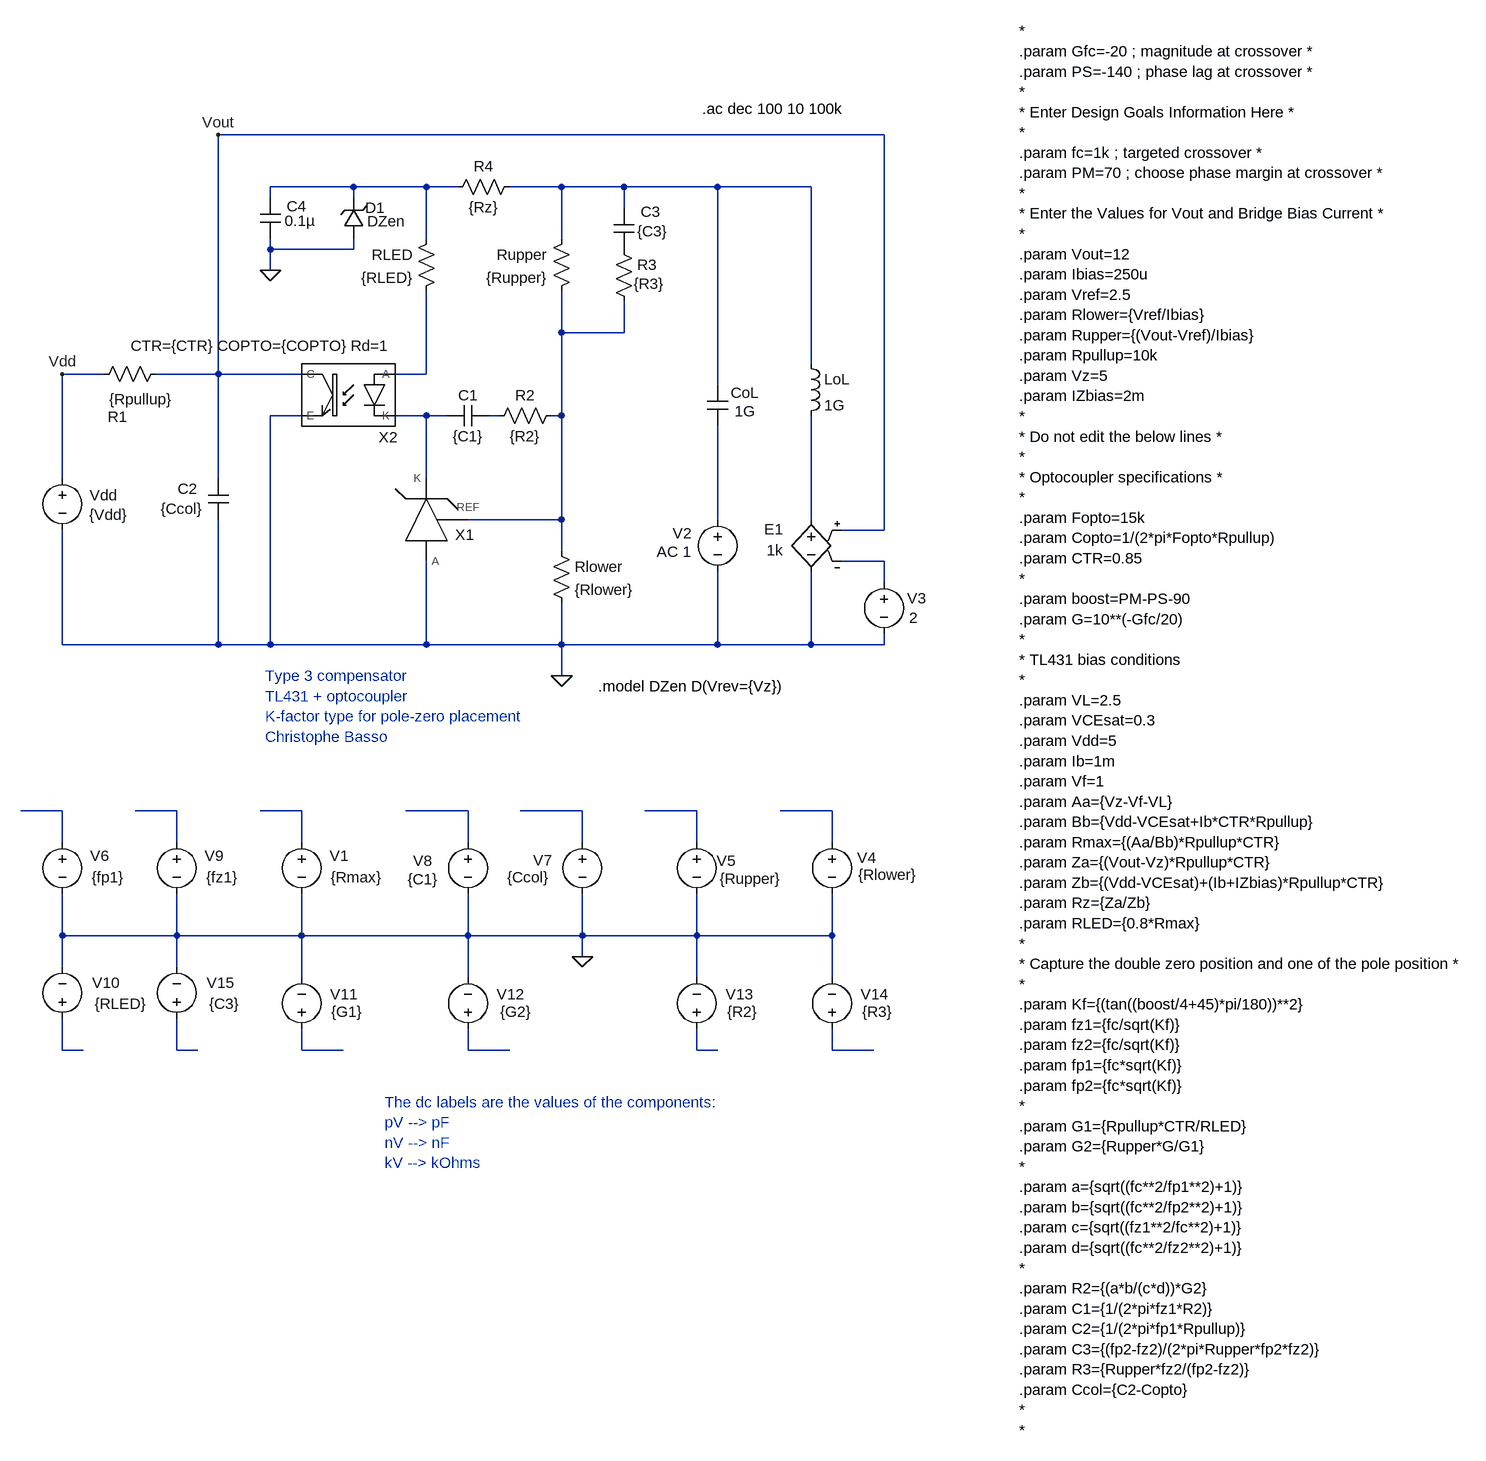
[diagram p0: schematic type 3 - TL431 - no fast lane.asc]
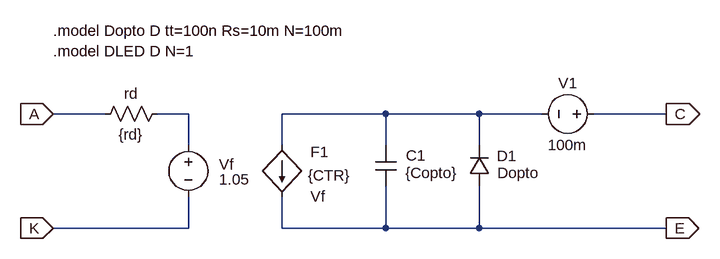
[diagram p1: sub-circuit optotof.asc]
type 3 - TL431 - no fast lane.asc, the LTspice schematic file:
Version 4.1
SHEET 1 2200 1456
WIRE 896 -400 -128 -400
WIRE 80 -320 -48 -320
WIRE 192 -320 80 -320
WIRE 240 -320 192 -320
WIRE 400 -320 320 -320
WIRE 496 -320 400 -320
WIRE 640 -320 496 -320
WIRE 784 -320 640 -320
WIRE -48 -304 -48 -320
WIRE 80 -304 80 -320
WIRE 496 -288 496 -320
WIRE 192 -240 192 -320
WIRE 400 -240 400 -320
WIRE -48 -224 -48 -240
WIRE 80 -224 80 -240
WIRE 80 -224 -48 -224
WIRE -48 -192 -48 -224
WIRE 400 -96 400 -160
WIRE 496 -96 496 -144
WIRE 496 -96 400 -96
WIRE 784 -48 784 -320
WIRE -304 -32 -368 -32
WIRE -128 -32 -128 -400
WIRE -128 -32 -224 -32
WIRE 0 -32 -128 -32
WIRE 192 -32 192 -160
WIRE 192 -32 144 -32
WIRE 640 -16 640 -320
WIRE 0 32 -48 32
WIRE 192 32 144 32
WIRE 224 32 192 32
WIRE 304 32 288 32
WIRE 400 32 400 -96
WIRE 400 32 384 32
WIRE -368 128 -368 -32
WIRE -128 128 -128 -32
WIRE 192 128 192 32
WIRE 400 192 400 32
WIRE 400 192 256 192
WIRE 640 192 640 48
WIRE 784 192 784 32
WIRE 896 208 896 -400
WIRE 896 208 832 208
WIRE 400 240 400 192
WIRE 896 256 832 256
WIRE 896 288 896 256
WIRE -368 384 -368 208
WIRE -128 384 -128 192
WIRE -128 384 -368 384
WIRE -48 384 -48 32
WIRE -48 384 -128 384
WIRE 192 384 192 256
WIRE 192 384 -48 384
WIRE 400 384 400 320
WIRE 400 384 192 384
WIRE 640 384 640 272
WIRE 640 384 400 384
WIRE 784 384 784 272
WIRE 784 384 640 384
WIRE 896 384 896 368
WIRE 896 384 784 384
WIRE 400 432 400 384
WIRE -368 640 -432 640
WIRE -192 640 -256 640
WIRE 0 640 -64 640
WIRE 256 640 160 640
WIRE 432 640 336 640
WIRE 608 640 528 640
WIRE 816 640 736 640
WIRE -368 688 -368 640
WIRE -192 688 -192 640
WIRE 0 688 0 640
WIRE 256 688 256 640
WIRE 432 688 432 640
WIRE 608 688 608 640
WIRE 816 688 816 640
WIRE -368 832 -368 768
WIRE -192 832 -192 768
WIRE -192 832 -368 832
WIRE 0 832 0 768
WIRE 0 832 -192 832
WIRE 256 832 256 768
WIRE 256 832 0 832
WIRE 432 832 432 768
WIRE 432 832 256 832
WIRE 608 832 608 768
WIRE 608 832 432 832
WIRE 816 832 816 768
WIRE 816 832 608 832
WIRE 432 864 432 832
WIRE -368 880 -368 832
WIRE -192 880 -192 832
WIRE 0 896 0 832
WIRE 256 896 256 832
WIRE 608 896 608 832
WIRE 816 896 816 832
WIRE -368 1008 -368 960
WIRE -336 1008 -368 1008
WIRE -192 1008 -192 960
WIRE -160 1008 -192 1008
WIRE 0 1008 0 976
WIRE 64 1008 0 1008
WIRE 256 1008 256 976
WIRE 320 1008 256 1008
WIRE 608 1008 608 976
WIRE 640 1008 608 1008
WIRE 816 1008 816 976
WIRE 880 1008 816 1008
FLAG -128 -400 Vout
FLAG 432 864 0
FLAG 400 432 0
FLAG -368 -32 Vdd
FLAG -48 -192 0
DATAFLAG 704 -320 ""
DATAFLAG 112 -400 ""
DATAFLAG 176 640 ""
DATAFLAG 368 640 ""
DATAFLAG 544 640 ""
DATAFLAG 768 640 ""
DATAFLAG 336 192 ""
DATAFLAG -48 640 ""
DATAFLAG -416 640 ""
DATAFLAG -240 640 ""
DATAFLAG -336 1008 ""
DATAFLAG 64 1008 ""
DATAFLAG 320 1008 ""
DATAFLAG 640 1008 ""
DATAFLAG 880 1008 ""
DATAFLAG -160 1008 ""
DATAFLAG 80 -320 ""
SYMBOL res 384 224 R0
SYMATTR InstName Rlower
SYMATTR Value {Rlower}
SYMBOL res 416 -256 M0
SYMATTR InstName Rupper
SYMATTR Value {Rupper}
SYMBOL cap 624 -16 R0
WINDOW 0 36 13 Left 2
WINDOW 3 42 41 Left 2
SYMATTR InstName CoL
SYMATTR Value 1G
SYMBOL voltage 640 176 M0
WINDOW 0 40 37 Left 2
WINDOW 123 40 65 Left 2
WINDOW 39 0 0 Left 0
SYMATTR InstName V2
SYMATTR Value2 AC 1
SYMATTR Value ""
SYMBOL ind 768 -64 R0
SYMATTR InstName LoL
SYMATTR Value 1G
SYMBOL e 784 176 M0
WINDOW 0 43 31 Left 2
WINDOW 3 43 63 Left 2
SYMATTR InstName E1
SYMATTR Value 1k
SYMBOL voltage 896 272 R0
WINDOW 0 36 41 Left 2
WINDOW 3 39 71 Left 2
SYMATTR InstName V3
SYMATTR Value 2
SYMBOL voltage 816 672 R0
WINDOW 0 39 40 Left 2
WINDOW 3 40 66 Left 2
WINDOW 123 0 0 Left 0
WINDOW 39 0 0 Left 0
SYMATTR InstName V4
SYMATTR Value {Rlower}
SYMBOL voltage 608 672 R0
WINDOW 0 31 45 Left 2
WINDOW 3 35 72 Left 2
WINDOW 123 0 0 Left 0
WINDOW 39 0 0 Left 0
SYMATTR InstName V5
SYMATTR Value {Rupper}
SYMBOL voltage 432 672 R0
WINDOW 0 -76 44 Left 2
WINDOW 3 -116 70 Left 2
SYMATTR InstName V7
SYMATTR Value {Ccol}
SYMBOL voltage 256 672 R0
WINDOW 0 -84 45 Left 2
WINDOW 3 -93 73 Left 2
WINDOW 123 0 0 Left 0
WINDOW 39 0 0 Left 0
SYMATTR InstName V8
SYMATTR Value {C1}
SYMBOL TL431TOF 176 144 R0
WINDOW 0 75 87 Bottom 2
SYMATTR InstName X1
SYMBOL res 208 -256 M0
SYMATTR InstName RLED
SYMATTR Value {RLED}
SYMBOL cap 288 16 R90
WINDOW 0 0 32 VBottom 2
WINDOW 3 32 32 VTop 2
SYMATTR InstName C1
SYMATTR Value {C1}
SYMBOL optoTOF 32 0 M0
WINDOW 0 -101 81 Bottom 2
WINDOW 39 93 -60 Bottom 2
SYMATTR InstName X2
SYMATTR SpiceLine CTR={CTR} COPTO={COPTO} Rd=1
SYMBOL cap -112 128 M0
WINDOW 0 48 16 Left 2
WINDOW 3 40 47 Left 2
SYMATTR InstName C2
SYMATTR Value {Ccol}
SYMBOL res -208 -48 R90
WINDOW 0 97 75 VBottom 2
WINDOW 3 39 39 VTop 2
SYMATTR InstName R1
SYMATTR Value {Rpullup}
SYMBOL voltage -368 112 R0
WINDOW 0 42 42 Left 2
WINDOW 3 41 72 Left 2
SYMATTR InstName Vdd
SYMATTR Value {Vdd}
SYMBOL voltage 0 672 R0
WINDOW 0 43 37 Left 2
WINDOW 3 45 70 Left 2
WINDOW 123 0 0 Left 0
WINDOW 39 0 0 Left 0
SYMATTR InstName V1
SYMATTR Value {Rmax}
SYMBOL voltage -368 672 R0
WINDOW 0 43 37 Left 2
WINDOW 3 45 70 Left 2
WINDOW 123 0 0 Left 0
WINDOW 39 0 0 Left 0
SYMATTR InstName V6
SYMATTR Value {fp1}
SYMBOL voltage -192 672 R0
WINDOW 0 43 37 Left 2
WINDOW 3 45 70 Left 2
WINDOW 123 0 0 Left 0
WINDOW 39 0 0 Left 0
SYMATTR InstName V9
SYMATTR Value {fz1}
SYMBOL voltage -368 976 M180
WINDOW 0 46 72 Left 2
WINDOW 3 50 39 Left 2
SYMATTR InstName V10
SYMATTR Value {RLED}
SYMBOL res 400 16 R90
WINDOW 0 0 56 VBottom 2
WINDOW 3 32 56 VTop 2
SYMATTR InstName R2
SYMATTR Value {R2}
SYMBOL voltage 0 992 R180
WINDOW 0 -87 70 Left 2
WINDOW 3 -94 43 Left 2
SYMATTR InstName V11
SYMATTR Value {G1}
SYMBOL cap 480 -288 R0
WINDOW 0 42 6 Left 2
WINDOW 3 36 36 Left 2
SYMATTR InstName C3
SYMATTR Value {C3}
SYMBOL res 480 -240 R0
WINDOW 3 31 69 Left 2
SYMATTR Value {R3}
SYMATTR InstName R3
SYMBOL res 336 -336 R90
WINDOW 0 0 56 VBottom 2
WINDOW 3 32 56 VTop 2
SYMATTR InstName R4
SYMATTR Value {Rz}
SYMBOL zener 96 -240 R180
WINDOW 0 -33 48 Left 2
WINDOW 3 -64 27 Left 2
SYMATTR InstName D1
SYMATTR Value DZen
SYMBOL cap -64 -304 R0
WINDOW 0 41 14 Left 2
WINDOW 3 38 36 Left 2
SYMATTR InstName C4
SYMATTR Value 0.1µ
SYMBOL voltage 256 992 R180
WINDOW 0 -87 70 Left 2
WINDOW 3 -98 43 Left 2
SYMATTR InstName V12
SYMATTR Value {G2}
SYMBOL voltage 608 992 R180
WINDOW 0 -87 70 Left 2
WINDOW 3 -94 43 Left 2
SYMATTR InstName V13
SYMATTR Value {R2}
SYMBOL voltage 816 992 R180
WINDOW 0 -87 70 Left 2
WINDOW 3 -94 43 Left 2
SYMATTR InstName V14
SYMATTR Value {R3}
SYMBOL voltage -192 976 M180
WINDOW 0 46 72 Left 2
WINDOW 3 50 39 Left 2
SYMATTR InstName V15
SYMATTR Value {C3}
TEXT 1104 -560 Left 2 !*\n.param Gfc=-20 ; magnitude at crossover *\n.param PS=-140 ; phase lag at crossover *\n*\n* Enter Design Goals Information Here *\n*\n.param fc=1k ; targeted crossover *\n.param PM=70 ; choose phase margin at crossover *\n*\n* Enter the Values for Vout and Bridge Bias Current *\n*\n.param Vout=12\n.param Ibias=250u\n.param Vref=2.5\n.param Rlower={Vref/Ibias}\n.param Rupper={(Vout-Vref)/Ibias}\n.param Rpullup=10k\n.param Vz=5\n.param IZbias=2m\n*\n* Do not edit the below lines *\n*\n* Optocoupler specifications *\n*\n.param Fopto=15k\n.param Copto=1/(2*pi*Fopto*Rpullup)\n.param CTR=0.85\n*\n.param boost=PM-PS-90 \n.param G=10**(-Gfc/20)\n*\n* TL431 bias conditions\n*\n.param VL=2.5\n.param VCEsat=0.3\n.param Vdd=5\n.param Ib=1m\n.param Vf=1\n.param Aa={Vz-Vf-VL}\n.param Bb={Vdd-VCEsat+Ib*CTR*Rpullup}\n.param Rmax={(Aa/Bb)*Rpullup*CTR}\n.param Za={(Vout-Vz)*Rpullup*CTR}\n.param Zb={(Vdd-VCEsat)+(Ib+IZbias)*Rpullup*CTR}\n.param Rz={Za/Zb}\n.param RLED={0.8*Rmax}\n*\n* Capture the double zero position and one of the pole position *\n*\n.param Kf={(tan((boost/4+45)*pi/180))**2}\n.param fz1={fc/sqrt(Kf)}\n.param fz2={fc/sqrt(Kf)}\n.param fp1={fc*sqrt(Kf)}\n.param fp2={fc*sqrt(Kf)}\n*\n.param G1={Rpullup*CTR/RLED}\n.param G2={Rupper*G/G1}\n*\n.param a={sqrt((fc**2/fp1**2)+1)}\n.param b={sqrt((fc**2/fp2**2)+1)}\n.param c={sqrt((fz1**2/fc**2)+1)}\n.param d={sqrt((fc**2/fz2**2)+1)}\n*\n.param R2={(a*b/(c*d))*G2}\n.param C1={1/(2*pi*fz1*R2)}\n.param C2={1/(2*pi*fp1*Rpullup)}\n.param C3={(fp2-fz2)/(2*pi*Rupper*fp2*fz2)}\n.param R3={Rupper*fz2/(fp2-fz2)}\n.param Ccol={C2-Copto}\n*\n*
TEXT 616 -440 Left 2 !.ac dec 100 10 100k
TEXT -56 432 Left 2 ;Type 3 compensator\nTL431 + optocoupler\nK-factor type for pole-zero placement\nChristophe Basso
TEXT 128 1088 Left 2 ;The dc labels are the values of the components:\npV --> pF\nnV --> nF\nkV --> kOhms
TEXT 456 448 Left 2 !.model DZen D(Vrev={Vz})

optotof.asc, the sub-circuit schematic file:
Version 4
SHEET 1 892 680
WIRE -48 32 -128 32
WIRE 80 32 32 32
WIRE 384 32 224 32
WIRE 528 32 384 32
WIRE 624 32 528 32
WIRE 816 32 704 32
WIRE 80 80 80 32
WIRE 224 80 224 32
WIRE 384 80 384 32
WIRE 528 80 528 32
WIRE 80 208 80 160
WIRE 80 208 -128 208
WIRE 224 208 224 160
WIRE 384 208 384 144
WIRE 384 208 224 208
WIRE 528 208 528 144
WIRE 528 208 384 208
WIRE 816 208 528 208
FLAG -128 32 A
IOPIN -128 32 In
FLAG -128 208 K
IOPIN -128 208 In
FLAG 816 32 C
IOPIN 816 32 Out
FLAG 816 208 E
IOPIN 816 208 Out
SYMBOL f 224 80 R0
WINDOW 0 44 11 Left 2
WINDOW 3 40 47 Left 2
WINDOW 38 44 79 Left 2
SYMATTR InstName F1
SYMATTR Value {CTR}
SYMATTR SpiceModel Vf
SYMBOL res 48 16 R90
WINDOW 0 0 56 VBottom 2
WINDOW 3 32 56 VTop 2
SYMATTR InstName rd
SYMATTR Value {rd}
SYMBOL voltage 80 64 R0
WINDOW 0 47 46 Left 2
WINDOW 3 47 69 Left 2
WINDOW 123 0 0 Left 0
WINDOW 39 0 0 Left 0
SYMATTR InstName Vf
SYMATTR Value 1.05
SYMBOL voltage 720 32 R90
WINDOW 0 -32 56 VBottom 2
WINDOW 3 32 56 VTop 2
SYMATTR InstName V1
SYMATTR Value 100m
SYMBOL cap 368 80 R0
WINDOW 0 47 16 Left 2
WINDOW 3 46 43 Left 2
SYMATTR InstName C1
SYMATTR Value {Copto}
SYMBOL diode 512 144 M180
WINDOW 0 43 47 Left 2
WINDOW 3 44 21 Left 2
SYMATTR InstName D1
SYMATTR Value Dopto
TEXT -128 -96 Left 2 !.model Dopto D tt=100n Rs=10m N=100m\n.model DLED D N=1

The netlist it stands for:
* type 3 - TL431 - no fast lane.asc
Rlower N003 0 {Rlower}
Rupper N002 N003 {Rupper}
CoL N002 N007 1G
V2 N007 0 AC 1
LoL N002 N008 1G
E1 N008 0 Vout N009 1k
V3 N009 0 2
V4 N016 0 {Rlower}
V5 N015 0 {Rupper}
V7 N014 0 {Ccol}
V8 N013 0 {C1}
X§X1 0 N003 N005 TL431TOF  ; pins A REF K
RLED N001 N004 {RLED}
C1 N006 N005 {C1}
X§X2 N004 N005 Vout 0 optotof params: CTR={CTR} COPTO={COPTO} Rd=1
C2 Vout 0 {Ccol}
R1 Vout Vdd {Rpullup}
Vdd Vdd 0 {Vdd}
V1 N012 0 {Rmax}
V6 N010 0 {fp1}
V9 N011 0 {fz1}
V10 N017 0 {RLED}
R2 N003 N006 {R2}
V11 N019 0 {G1}
C3 N002 P001 {C3}
R3 P001 N003 {R3}
R4 N002 N001 {Rz}
D1 0 N001 DZen
C4 N001 0 0.1µ
V12 N020 0 {G2}
V13 N021 0 {R2}
V14 N022 0 {R3}
V15 N018 0 {C3}

* block symbol definitions
.subckt optotof A K C E
F1 N002 E Vf {CTR}
rd N001 A {rd}
Vf N001 K 1.05
V1 C N002 100m
C1 N002 E {Copto}
D1 E N002 Dopto
.model Dopto D tt=100n Rs=10m N=100m
.model DLED D N=1
.ends optotof

.model D D
.lib standard.dio
*
.param Gfc=-20 ; magnitude at crossover *
.param PS=-140 ; phase lag at crossover *
*
* Enter Design Goals Information Here *
*
.param fc=1k ; targeted crossover *
.param PM=70 ; choose phase margin at crossover *
*
* Enter the Values for Vout and Bridge Bias Current *
*
.param Vout=12
.param Ibias=250u
.param Vref=2.5
.param Rlower={Vref/Ibias}
.param Rupper={(Vout-Vref)/Ibias}
.param Rpullup=10k
.param Vz=5
.param IZbias=2m
*
* Do not edit the below lines *
*
* Optocoupler specifications *
*
.param Fopto=15k
.param Copto=1/(2*pi*Fopto*Rpullup)
.param CTR=0.85
*
.param boost=PM-PS-90
.param G=10**(-Gfc/20)
*
* TL431 bias conditions
*
.param VL=2.5
.param VCEsat=0.3
.param Vdd=5
.param Ib=1m
.param Vf=1
.param Aa={Vz-Vf-VL}
.param Bb={Vdd-VCEsat+Ib*CTR*Rpullup}
.param Rmax={(Aa/Bb)*Rpullup*CTR}
.param Za={(Vout-Vz)*Rpullup*CTR}
.param Zb={(Vdd-VCEsat)+(Ib+IZbias)*Rpullup*CTR}
.param Rz={Za/Zb}
.param RLED={0.8*Rmax}
*
* Capture the double zero position and one of the pole position *
*
.param Kf={(tan((boost/4+45)*pi/180))**2}
.param fz1={fc/sqrt(Kf)}
.param fz2={fc/sqrt(Kf)}
.param fp1={fc*sqrt(Kf)}
.param fp2={fc*sqrt(Kf)}
*
.param G1={Rpullup*CTR/RLED}
.param G2={Rupper*G/G1}
*
.param a={sqrt((fc**2/fp1**2)+1)}
.param b={sqrt((fc**2/fp2**2)+1)}
.param c={sqrt((fz1**2/fc**2)+1)}
.param d={sqrt((fc**2/fz2**2)+1)}
*
.param R2={(a*b/(c*d))*G2}
.param C1={1/(2*pi*fz1*R2)}
.param C2={1/(2*pi*fp1*Rpullup)}
.param C3={(fp2-fz2)/(2*pi*Rupper*fp2*fz2)}
.param R3={Rupper*fz2/(fp2-fz2)}
.param Ccol={C2-Copto}
*
*
.ac dec 100 10 100k
* Type 3 compensator
* TL431 + optocoupler
* K-factor type for pole-zero placement
* Christophe Basso
* The dc labels are the values of the components:
* pV --> pF
* nV --> nF
* kV --> kOhms
.model DZen D(Vrev={Vz})
.backanno
.end